# EAGLE design M109X (EAGLE 6.6.0)
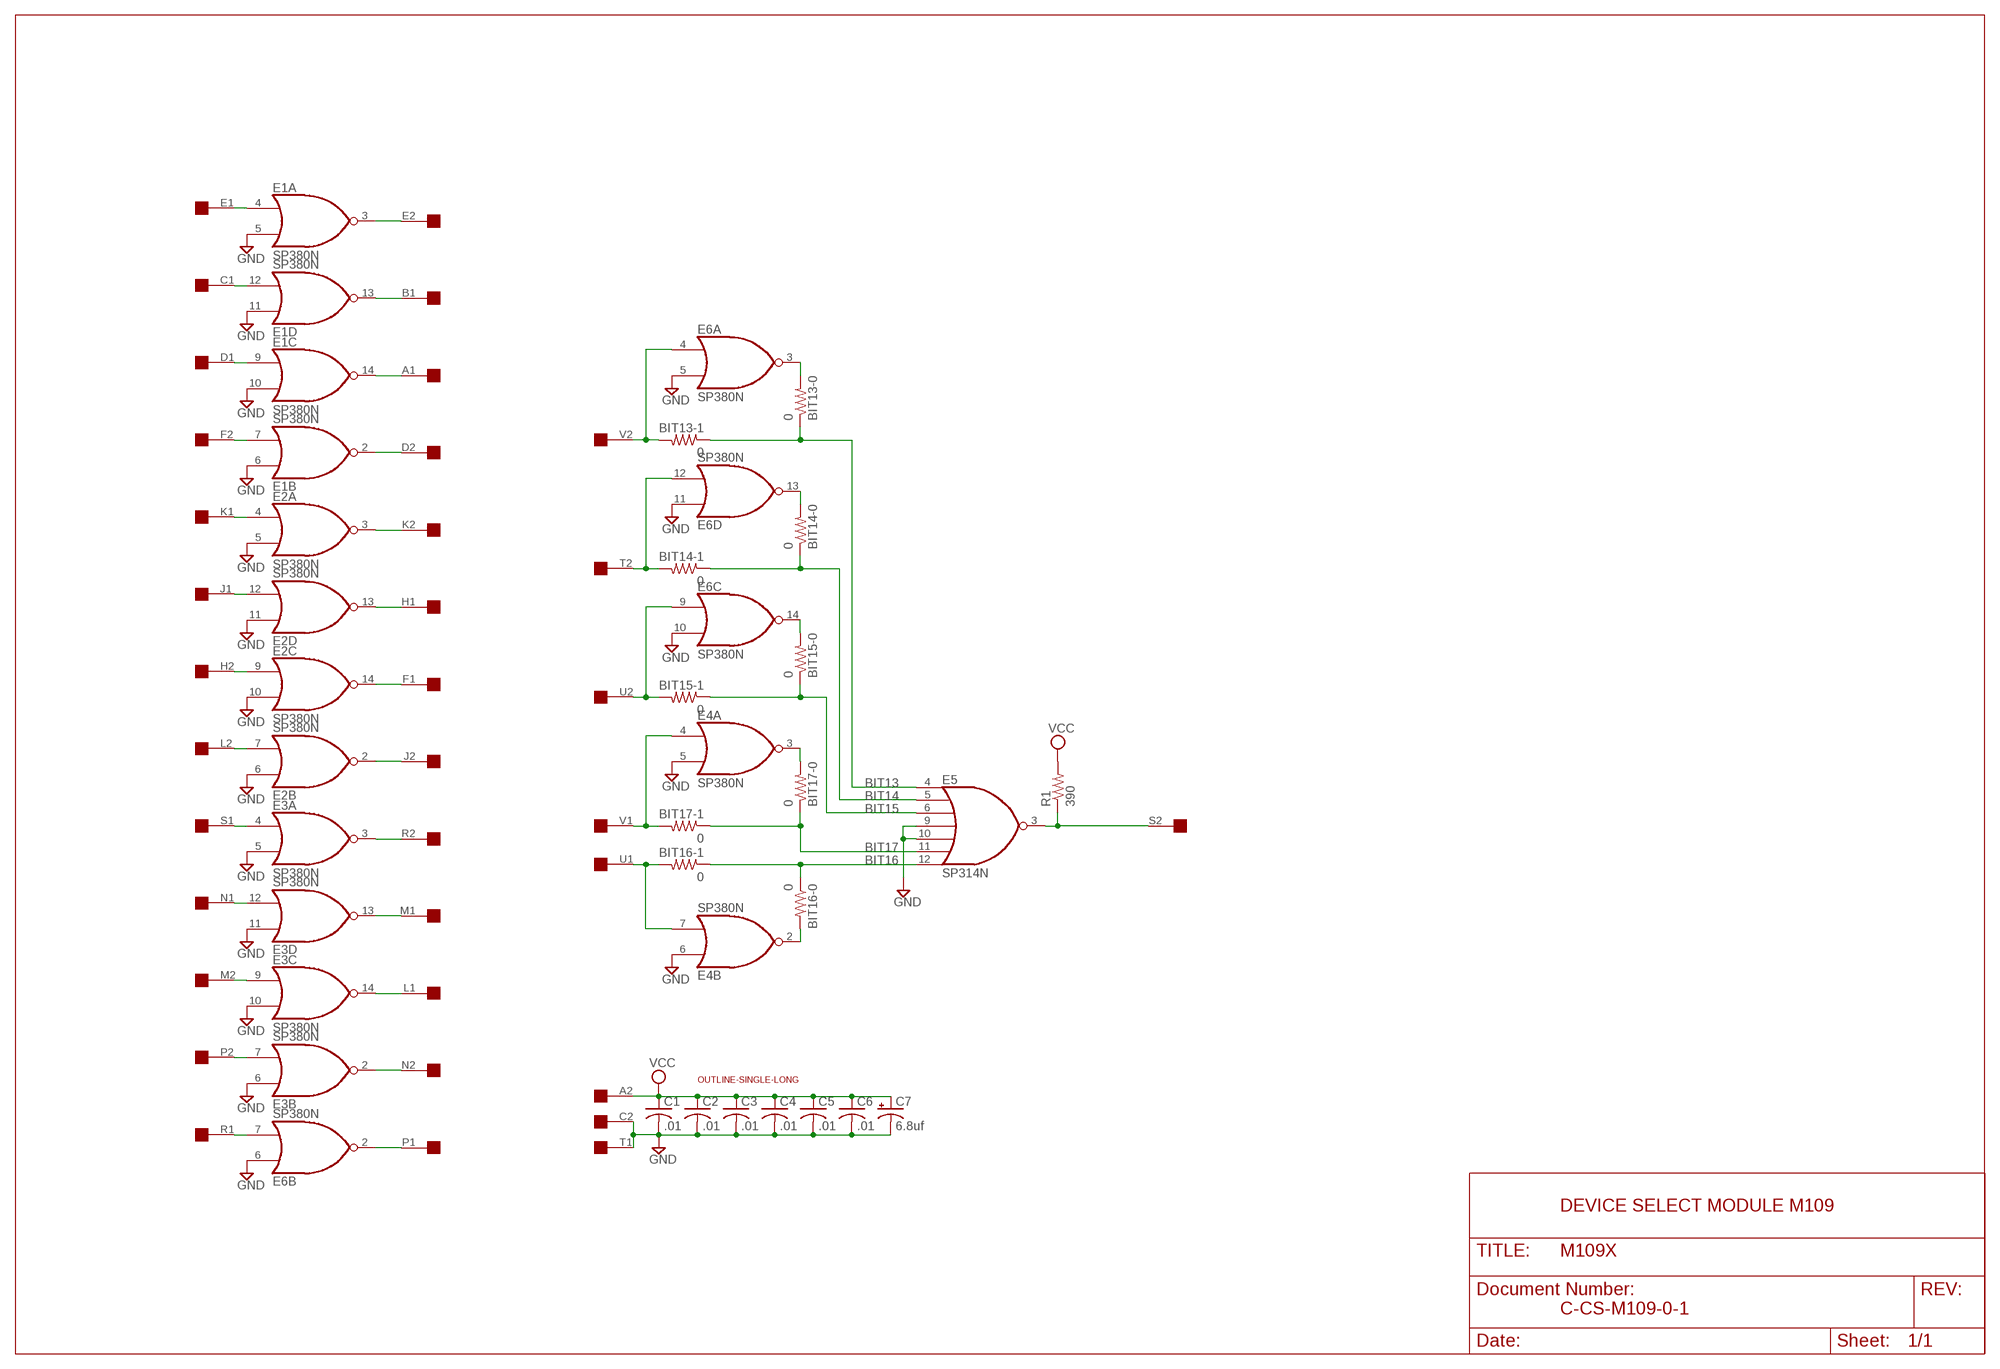
[diagram p0: schematic, sheet 1]

## Parts
BIT13-0  0  R-US_0207/10  [0207/10]
BIT13-1  0  R-US_0207/10  [0207/10]
BIT14-0  0  R-US_0207/10  [0207/10]
BIT14-1  0  R-US_0207/10  [0207/10]
BIT15-0  0  R-US_0207/10  [0207/10]
BIT15-1  0  R-US_0207/10  [0207/10]
BIT16-0  0  R-US_0207/10  [0207/10]
BIT16-1  0  R-US_0207/10  [0207/10]
BIT17-0  0  R-US_0207/10  [0207/10]
BIT17-1  0  R-US_0207/10  [0207/10]
C1  .01  C-US050-025X075  [C050-025X075]
C2  .01  C-US050-025X075  [C050-025X075]
C3  .01  C-US050-025X075  [C050-025X075]
C4  .01  C-US050-025X075  [C050-025X075]
C5  .01  C-US050-025X075  [C050-025X075]
C6  .01  C-US050-025X075  [C050-025X075]
C7  6.8uf  CPOL-USE22-6AXIAL  [E22-6]
E1  SP380N  [DIL14]
E2  SP380N  [DIL14]
E3  SP380N  [DIL14]
E4  SP380N  [DIL14]
E5  SP314N  [DIL14]
E6  SP380N  [DIL14]
R1  390  R-US_0207/10  [0207/10]
U$1  SINGLE  [EDGE-CON2]
U$2  OUTLINE-SINGLE-LONG  [SINGLE-LONG]

## Nets
BIT13: BIT13-0.1 BIT13-1.1 E5.4(I0)
BIT14: BIT14-0.1 BIT14-1.1 E5.5(I1)
BIT15: BIT15-0.1 BIT15-1.1 E5.6(I2)
BIT16: BIT16-0.1 BIT16-1.1 E5.12(I6)
BIT17: BIT17-0.1 BIT17-1.1 E5.11(I5)
GND [Supply]: C1.2 C2.2 C3.2 C4.2 C5.2 C6.2 C7.- E1.5(A:I1) E1.6(B:I0) E1.10(C:I1) E1.11(D:I0) E2.5(A:I1) E2.6(B:I0) E2.10(C:I1) E2.11(D:I0) E3.5(A:I1) E3.6(B:I0) E3.10(C:I1) E3.11(D:I0) E4.5(A:I1) E4.6(B:I0) E5.9(I3) E5.10(I4) E6.5(A:I1) E6.6(B:I0) E6.10(C:I1) E6.11(D:I0) U$1.C2 U$1.T1
N$1: E1.4(A:I0) U$1.E1
N$2: E2.12(D:I1) U$1.J1
N$3: E1.3(A:O) U$1.E2
N$4: E1.2(B:O) U$1.D2
N$5: E2.9(C:I0) U$1.H2
N$6: E2.3(A:O) U$1.K2
N$7: E2.13(D:O) U$1.H1
N$8: E3.13(D:O) U$1.M1
N$9: BIT15-0.2 E6.14(C:O)
N$10: E3.7(B:I1) U$1.P2
N$11: E6.7(B:I1) U$1.R1
N$12: E3.2(B:O) U$1.N2
N$13: BIT17-1.2 E4.4(A:I0) U$1.V1
N$14: BIT14-1.2 E6.12(D:I1) U$1.T2
N$15: BIT15-1.2 E6.9(C:I0) U$1.U2
N$16: E6.2(B:O) U$1.P1
N$17: E1.12(D:I1) U$1.C1
N$18: E1.7(B:I1) U$1.F2
N$19: E1.9(C:I0) U$1.D1
N$20: BIT14-0.2 E6.13(D:O)
N$21: BIT17-0.2 E4.3(A:O)
N$22: E1.14(C:O) U$1.A1
N$23: E1.13(D:O) U$1.B1
N$24: E2.14(C:O) U$1.F1
N$25: E2.2(B:O) U$1.J2
N$26: E2.7(B:I1) U$1.L2
N$27: E2.4(A:I0) U$1.K1
N$28: E3.14(C:O) U$1.L1
N$29: E3.12(D:I1) U$1.N1
N$30: E3.9(C:I0) U$1.M2
N$31: BIT16-1.2 E4.7(B:I1) U$1.U1
N$32: E3.3(A:O) U$1.R2
N$33: BIT16-0.2 E4.2(B:O)
N$34: BIT13-1.2 E6.4(A:I0) U$1.V2
N$35: BIT13-0.2 E6.3(A:O)
N$37: E5.3(O) R1.1 U$1.S2
N$38: E3.4(A:I0) U$1.S1
VCC [Supply]: C1.1 C2.1 C3.1 C4.1 C5.1 C6.1 C7.+ R1.2 U$1.A2
Unconnected: E4.9(C:I0) E4.10(C:I1) E4.11(D:I0) E4.12(D:I1) E4.13(D:O) E4.14(C:O) U$1.B2

## Notes on the sheet
- DEVICE SELECT MODULE M109
- C-CS-M109-0-1

## Power pins joined to a net without a drawn wire
GND: E1.1(P:GND) E2.1(P:GND) E3.1(P:GND) E4.1(P:GND) E5.1(GND) E6.1(P:GND)
VCC: E1.8(P:VCC) E2.8(P:VCC) E3.8(P:VCC) E4.8(P:VCC) E5.8(VCC) E6.8(P:VCC)

## Library data of the parts
BIT13-0 BIT13-1 BIT14-0 BIT14-1 BIT15-0 BIT15-1 BIT16-0 BIT16-1 BIT17-0 BIT17-1 R1 = rcl:R-US_: RESISTOR, American symbol
C1-C6 = rcl:C-US: CAPACITOR, American symbol
C7 = rcl:CPOL-US: POLARIZED CAPACITOR, American symbol
E1-E4 E6 = dec-con:SP380: Quad NOR gate (use 8640)
E5 = dec-con:SP314: 7-Input NOR gate
U$1 = dec-con:SINGLE: Single-Height DEC board
U$2 = dec-con:OUTLINE-*: Board outlines for DEC boards.

## Net classes
1 Supply: width 0.813 mm

## Board
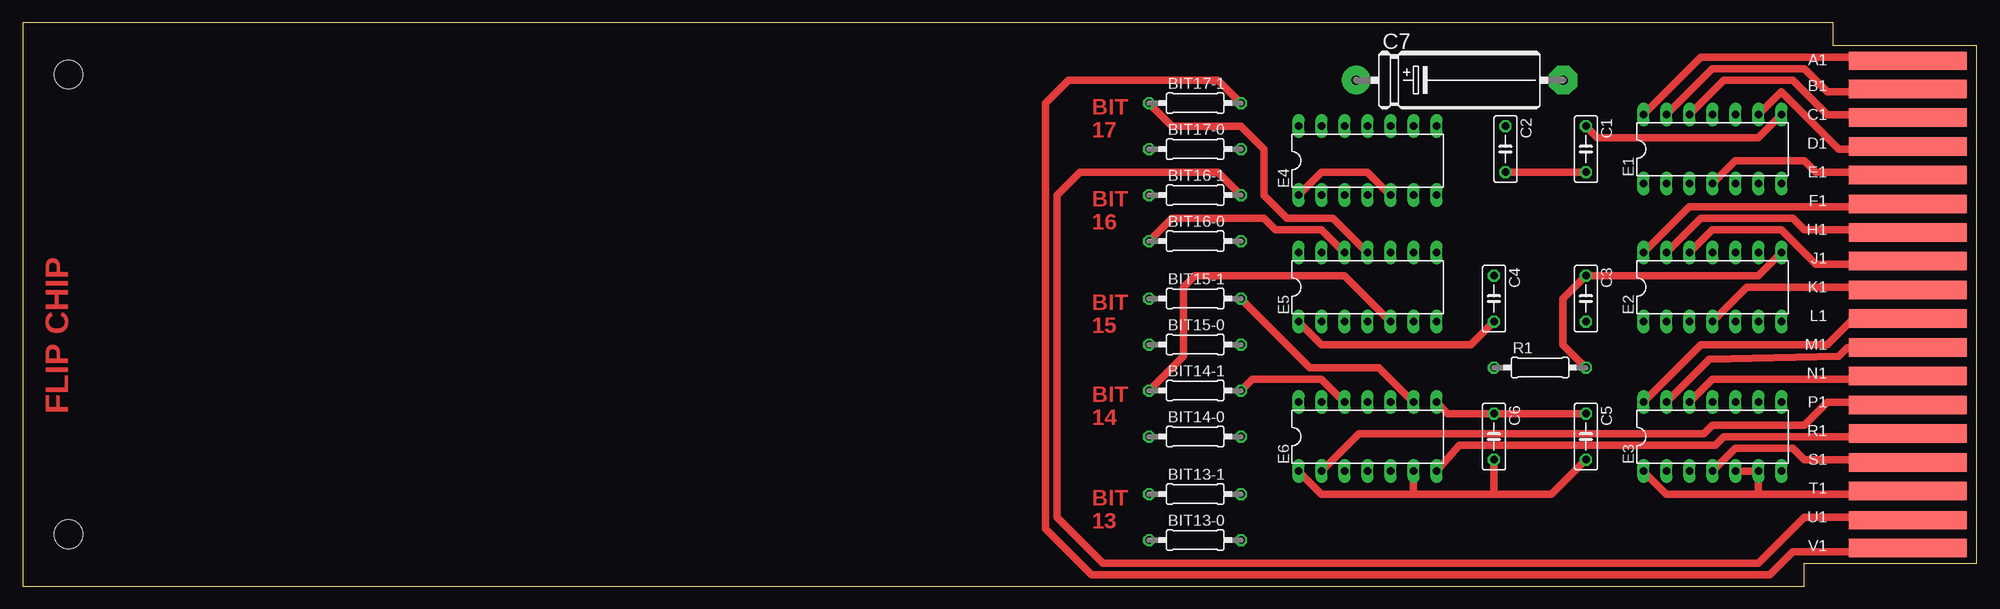
[diagram p1: board, top side]
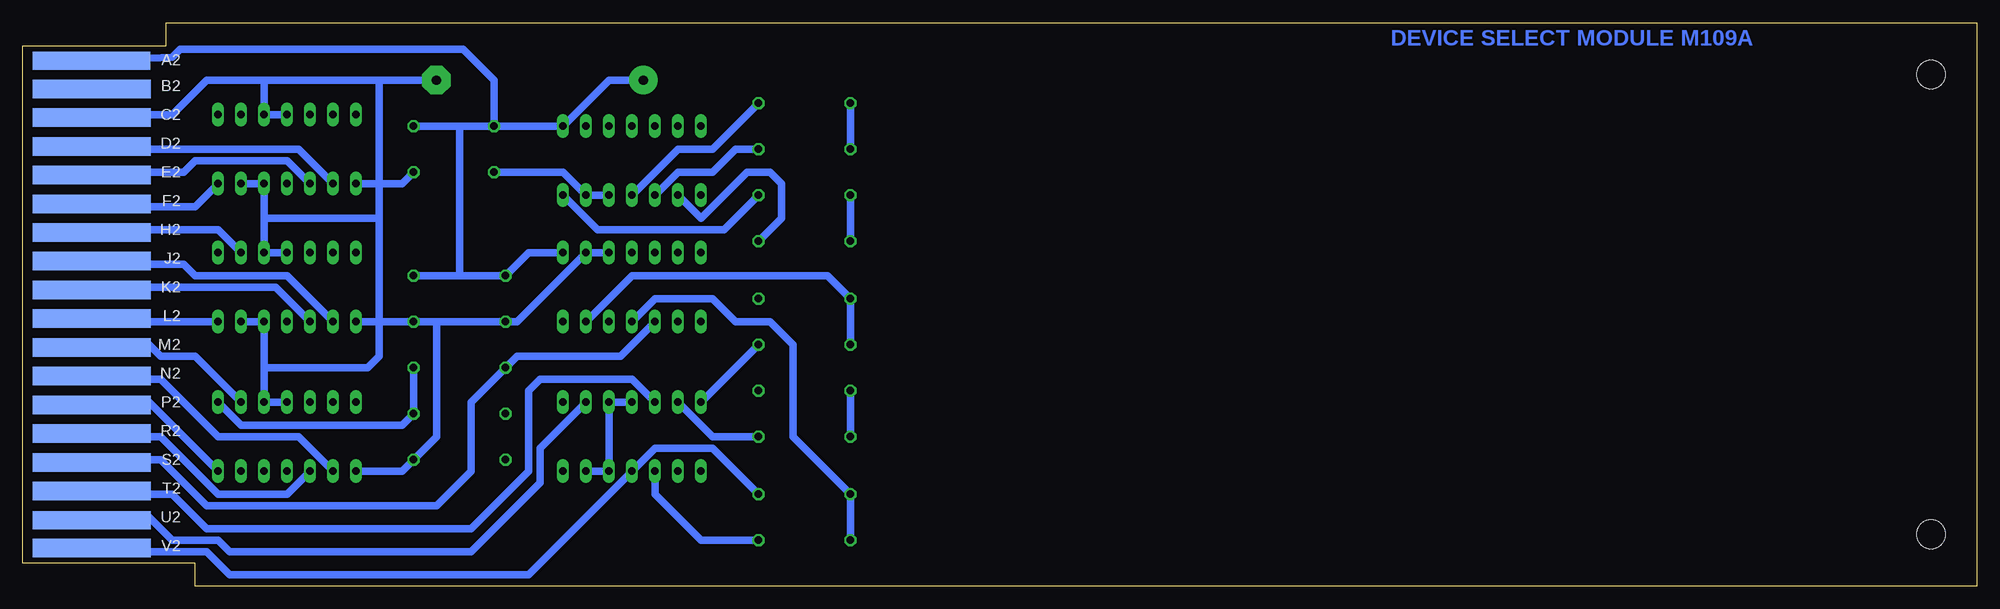
[diagram p2: board, bottom side, seen from below]

Size 215.9 x 62.23 mm. Coordinates in mm from the lower left corner, seen from the top.
Outline: 200.03,59.69 200.03,62.23
Copper layers (1+16): Top 0.035mm / dielectric 1.5mm / Bottom 0.035mm
Design rules "16mils": minimum track width 16mil, minimum drill 32mil, track to track 15mil, track to pad 10mil, pad to pad 10mil, via to via 10mil, smd to smd 10mil, copper to edge 25mil, drill to drill 10mil, minimum pad ring 10mil, minimum via ring 8mil, stop-mask expansion 0mil, vias tented up to drill 0mil, thermal gap 10mil

### Footprints (pad centres in the part's own frame; a part is rotated, then mirrored left to right if it is on the bottom)
0207/10 = drill 0.813 octagon: 1 -5.08,0; 2 5.08,0
C050-025X075 = drill 0.813 octagon: 1 -2.54,0; 2 2.54,0
E22-6 = drill 1.016 pad 3.15 round: + -11.43,0 | drill 1.016 pad 3.15 octagon: - 11.43,0
DIL14 = drill 0.813 long: 1 -7.62,-3.81; 2 -5.08,-3.81; 3 -2.54,-3.81; 4 0,-3.81; 5 2.54,-3.81; 6 5.08,-3.81; 7 7.62,-3.81; 8 7.62,3.81; 9 5.08,3.81; 10 2.54,3.81; 11 0,3.81; 12 -2.54,3.81; 13 -5.08,3.81; 14 -7.62,3.81
EDGE-CON2 = smd 13.017 x 2.032: A1 7.633,4.207; B1 7.639,7.327; C1 7.636,10.489; D1 7.633,13.665; E1 7.642,16.84; F1 7.642,20.041; H1 7.642,23.19; J1 7.642,26.34; K1 7.642,29.515; L1 7.642,32.69; M1 7.642,35.89; N1 7.642,39.04; P1 7.642,42.24; R1 7.642,45.39; S1 7.642,48.565; T1 7.642,51.74; U1 7.642,54.966; V1 7.642,58.026 | smd 13.017 x 2.032 bottom: A2 7.614,4.207; B2 7.642,7.328; C2 7.617,10.49; D2 7.642,13.665; E2 7.642,16.84; F2 7.617,20.041; H2 7.617,23.19; J2 7.642,26.34; K2 7.642,29.515; L2 7.642,32.69; M2 7.642,35.89; N2 7.642,39.04; P2 7.642,42.24; R2 7.642,45.39; S2 7.642,48.565; T2 7.642,51.74; U2 7.642,54.966; V2 7.642,58.026
SINGLE-LONG = hole 3.175: 210.82,56.515; 210.82,5.715

### Placement (x,y rotation side)
BIT13-0  129.54,5.08 0 top
BIT13-1  129.54,10.16 0 top
BIT14-0  129.54,16.51 0 top
BIT14-1  129.54,21.59 0 top
BIT15-0  129.54,26.67 0 top
BIT15-1  129.54,31.75 0 top
BIT16-0  129.54,38.1 0 top
BIT16-1  129.54,43.18 0 top
BIT17-0  129.54,48.26 0 top
BIT17-1  129.54,53.34 0 top
C1  172.72,48.26 270 top
C2  163.83,48.26 270 top
C3  172.72,31.75 270 top
C4  162.56,31.75 270 top
C5  172.72,16.51 270 top
C6  162.56,16.51 270 top
C7  158.75,55.88 0 top
E1  186.69,48.26 0 top
E2  186.69,33.02 0 top
E3  186.69,16.51 0 top
E4  148.59,46.99 0 top
E5  148.59,33.02 0 top
E6  148.59,16.51 0 top
R1  167.64,24.13 0 top
U$1  215.9,62.23 180 top
U$2  215.9,62.23 180 top
U$3  [FLIPCHIP]  0,0 0 top

### Tracks (layer width: path | path; a pad name or v marks a point on that pad's centre or on a via)
BIT13
  Bottom 0.813: BIT13-0.1 BIT13-1.1 130.81,16.51 130.81,26.67 133.35,29.21 137.16,29.21 139.7,31.75 146.05,31.75 E5.4
BIT14
  Top 0.813: BIT14-1.1 128.27,25.4 128.27,33.02 129.54,34.29 146.05,34.29 E5.5
  Bottom 0.813: BIT14-0.1 BIT14-1.1
BIT15
  Bottom 0.813: BIT15-0.1 BIT15-1.1 127,34.29 148.59,34.29 E5.6
BIT16
  Top 0.813: BIT16-0.1 127,40.64 137.16,40.64 138.43,39.37 143.51,39.37 E5.12
  Bottom 0.813: BIT16-0.1 BIT16-1.1
BIT17
  Top 0.813: E5.11 144.78,40.64 139.7,40.64 137.16,43.18 137.16,48.26 134.62,50.8 127,50.8 BIT17-1.1
  Bottom 0.813: BIT17-0.1 BIT17-1.1
GND
  Top 0.813: E6.1 143.51,10.16 153.67,10.16 | 153.67,10.16 E6.6 | 162.56,10.16 C6.2 | 162.56,10.16 153.67,10.16 | C5.2 168.91,10.16 162.56,10.16 | U$1.T1 206.07,10.49 205.74,10.16 191.77,10.16 | 191.77,10.16 181.61,10.16 E3.1 | E3.5 E3.6 191.77,10.16 | E5.1 143.51,26.67 160.02,26.67 C4.2 | C1.2 C2.2 | E4.1 143.51,45.72 148.59,45.72 E4.5
  Bottom 0.813: E6.6 E6.5 E6.10 E6.11 | 170.18,29.21 C3.2 176.53,29.21 | 170.18,29.21 C4.2 161.29,29.21 E5.9 E5.10 | E1.6 E1.5 189.23,40.64 | 189.23,40.64 E2.10 E2.11 | U$1.C2 207.34,51.74 207.01,52.07 199.39,52.07 195.58,55.88 189.23,55.88 | 189.23,55.88 176.53,55.88 | 176.53,55.88 176.53,44.45 | 176.53,44.45 E1.1 | C1.2 173.99,44.45 176.53,44.45 | 176.53,55.88 C7.- | 176.53,44.45 176.53,40.64 | 176.53,40.64 189.23,40.64 | 176.53,29.21 E2.1 | 176.53,40.64 176.53,29.21 | 189.23,24.13 E3.10 E3.11 | 189.23,24.13 E2.5 E2.6 | 176.53,29.21 176.53,25.4 177.8,24.13 189.23,24.13 | E3.1 173.99,12.7 C5.2 170.18,16.51 170.18,29.21 | E1.11 E1.10 189.23,55.88 | E4.5 E4.6 156.21,45.72 C2.2
N$1
  Top 0.813: U$1.E1 206.07,45.39 205.74,45.72 198.12,45.72 196.85,46.99 189.23,46.99 E1.4
N$2
  Top 0.813: E2.12 186.69,39.37 194.31,39.37 198.12,35.56 205.74,35.56 206.07,35.89 U$1.J1
N$3
  Bottom 0.813: U$1.E2 206.07,45.39 205.74,45.72 198.12,45.72 196.85,46.99 186.69,46.99 E1.3
N$4
  Bottom 0.813: U$1.D2 206.04,48.56 205.74,48.26 185.42,48.26 E1.2
N$5
  Bottom 0.813: U$1.H2 206.07,39.04 205.74,39.37 194.31,39.37 E2.9
N$6
  Bottom 0.813: U$1.K2 207.31,32.72 207.01,33.02 187.96,33.02 E2.3
N$7
  Top 0.813: E2.13 185.42,40.64 195.58,40.64 196.85,39.37 205.74,39.37 206.07,39.04 U$1.H1
N$8
  Top 0.813: U$1.M1 201.6,26.34 200.66,25.4 186.36,25.07 E3.13
N$9
  Bottom 0.813: E6.14 BIT15-0.2
N$10
  Bottom 0.813: E3.7 201.93,20.32 207.01,20.32 207.34,19.99 U$1.P2
N$11
  Top 0.813: E6.7 158.75,15.56 187.01,15.56 187.96,16.51 205.74,16.51 206.07,16.84 U$1.R1
N$12
  Bottom 0.813: U$1.N2 206.07,23.19 205.74,22.86 200.66,22.86 194.31,16.51 185.42,16.51 E3.2
N$13
  Top 0.813: U$1.V1 207.4,4.2 207.01,3.81 195.58,3.81 193.04,1.27 118.11,1.27 113.03,6.35 113.03,53.34 115.57,55.88 132.08,55.88 BIT17-1.2
  Bottom 0.813: BIT17-1.2 139.7,48.26 143.51,48.26 E4.4
N$14
  Top 0.813: BIT14-1.2 135.89,22.86 143.51,22.86 E6.12
  Bottom 0.813: U$1.T2 206.07,10.49 205.74,10.16 199.39,10.16 195.58,6.35 166.37,6.35 160.02,12.7 160.02,21.59 158.75,22.86 148.59,22.86 E6.12
N$15
  Top 0.813: E6.9 149.86,24.13 142.24,24.13 BIT15-1.2
  Bottom 0.813: U$1.U2 206.1,7.26 205.74,7.62 201.93,7.62 199.39,5.08 194.31,5.08 193.04,3.81 166.37,3.81 158.75,11.43 158.75,15.24 E6.9
N$16
  Top 0.813: E6.2 147.64,16.83 185.74,16.83 186.69,17.78 196.85,17.78 199.39,20.32 205.74,20.32 206.07,19.99 U$1.P1
N$17
  Top 0.813: E1.12 187.96,55.88 195.58,55.88 199.39,52.07 207.01,52.07 207.34,51.74 U$1.C1
N$18
  Bottom 0.813: U$1.F2 207.29,42.19 207.01,41.91 196.85,41.91 E1.7
N$19
  Top 0.813: E1.9 194.31,54.61 200.66,48.26 205.74,48.26 206.04,48.56 U$1.D1
N$20
  Bottom 0.813: BIT14-0.2 139.7,16.51 E6.13
N$21
  Bottom 0.813: BIT17-0.2 137.16,48.26 139.7,45.72 143.51,45.72 E4.3
N$22
  Top 0.813: E1.14 185.42,58.42 198.12,58.42 | 198.12,58.42 199.39,58.42 | U$1.A1 206.14,58.02 205.74,58.42 198.12,58.42
N$23
  Top 0.813: E1.13 186.69,57.15 196.85,57.15 199.39,54.61 207.01,54.61 207.3,54.9 U$1.B1
N$24
  Top 0.813: E2.14 184.15,41.91 204.47,41.91 204.75,42.19 U$1.F1
N$25
  Bottom 0.813: U$1.J2 206.07,35.89 205.74,35.56 198.12,35.56 196.85,34.29 186.69,34.29 E2.2
N$26
  Bottom 0.813: U$1.L2 207.34,29.54 207.01,29.21 E2.7
N$27
  Top 0.813: U$1.K1 206.04,32.72 205.74,33.02 190.5,33.02 E2.4
N$28
  Top 0.813: U$1.L1 203.53,29.54 203.2,29.21 201.93,29.21 199.39,26.67 185.42,26.67 E3.14
N$29
  Top 0.813: U$1.N1 206.07,23.19 205.74,22.86 186.69,22.86 E3.12
N$30
  Bottom 0.813: U$1.M2 207.34,26.34 207.01,26.67 201.93,26.67 200.66,25.4 196.85,25.4 E3.9
N$31
  Top 0.813: U$1.U1 206.1,7.26 205.74,7.62 196.85,7.62 191.77,2.54 119.38,2.54 114.3,7.62 114.3,43.18 116.84,45.72 132.08,45.72 BIT16-1.2
  Bottom 0.813: BIT16-1.2 138.43,39.37 152.4,39.37 E4.7
N$32
  Bottom 0.813: U$1.R2 207.34,16.84 207.01,16.51 200.66,16.51 194.31,10.16 186.69,10.16 E3.3
N$33
  Bottom 0.813: BIT16-0.2 132.08,40.64 132.08,44.45 133.35,45.72 135.89,45.72 140.97,40.64 E4.2
N$34
  Bottom 0.813: BIT13-1.2 139.7,15.24 146.05,15.24 E6.4 160.02,1.27 193.04,1.27 195.58,3.81 207.01,3.81 207.4,4.2 U$1.V2
N$35
  Bottom 0.813: BIT13-0.2 140.97,5.08 146.05,10.16 E6.3
N$37
  Bottom 0.813: E5.3 149.86,25.4 161.29,25.4 R1.1 166.37,20.32 166.37,12.7 170.18,8.89 195.58,8.89 200.66,13.97 205.74,13.97 206.04,13.66 U$1.S2
N$38
  Top 0.813: E3.4 189.23,15.24 195.58,15.24 196.85,13.97 205.74,13.97 206.04,13.66 U$1.S1
VCC
  Top 0.813: E6.8 157.48,19.05 C6.1 C5.1 | R1.2 170.18,26.67 170.18,31.75 C3.1 191.77,34.29 E2.8 | E1.8 191.77,49.53 173.99,49.53 C1.1
  Bottom 0.813: 167.64,34.29 C4.1 160.02,36.83 E5.8 | 167.64,34.29 C3.1 | U$1.A2 199.39,58.42 198.52,59.29 167.24,59.29 163.83,55.88 C2.1 | C2.1 E4.8 151.13,55.88 C7.+ | C2.1 167.64,50.8 | 167.64,50.8 C1.1 | 167.64,50.8 167.64,34.29 | R1.2 C5.1 173.99,17.78 191.77,17.78 E3.8

### Text on the board
Top: BIT | 17 | BIT | 16 | BIT | 15 | BIT | 14 | BIT | 13
Bottom: DEVICE SELECT MODULE M109A